# EAGLE design PCBMINI (EAGLE 9.2.0)
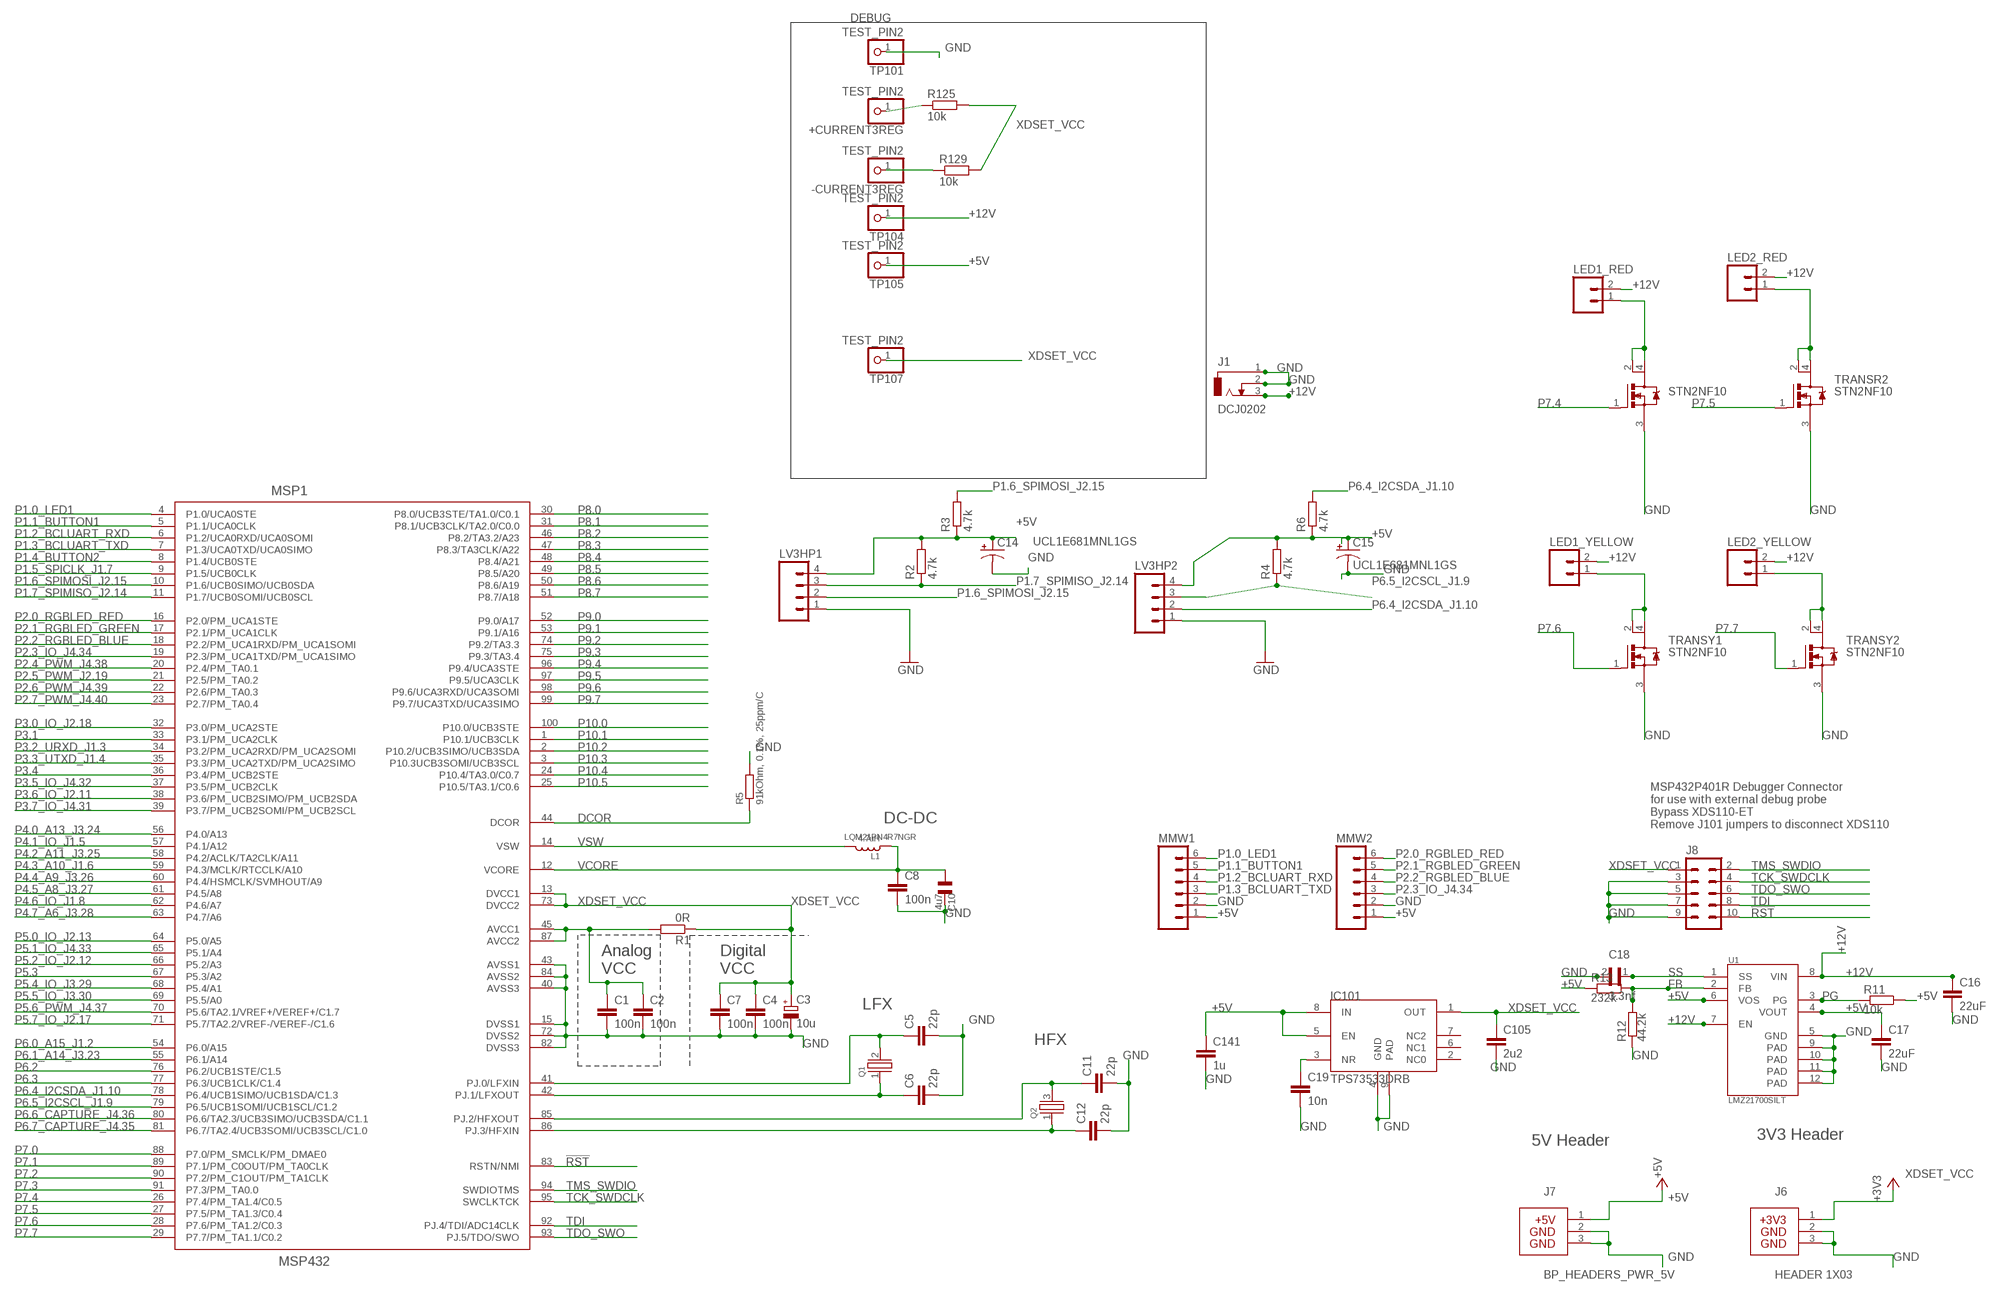
[diagram p0: schematic, sheet 1, part 1 of 2]
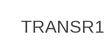
[diagram p1: schematic, sheet 1, part 2 of 2]

## Parts
+CURRENT3REG  TEST_PIN2  PINHD-1X1  [1X01]
-CURRENT3REG  TEST_PIN2  PINHD-1X1  [1X01]
C1  100n  C-EUCM0402  [0402]
C2  100n  C-EUCM0402  [0402]
C3  10u  CPOL-EUA/3216-18R  [A/3216-18R]
C4  100n  C-EUCM0402  [0402]
C5  22p  C-EUCM0402  [0402]
C6  22p  C-EUCM0402  [0402]
C7  100n  C-EUCM0402  [0402]
C8  100n  C-EUCM0402  [0402]
C10  4u7  CSMD0805  [CSMD0805]
C11  22p  C-EUCM0402  [0402]
C12  22p  C-EUCM0402  [0402]
C14  UCL1E681MNL1GS  [CAPAE1030X1350N]
C15  UCL1E681MNL1GS  [CAPAE1030X1350N]
C16  22uF  22UF-0805-6.3V-20%  [0805]
C17  22uF  22UF-0805-6.3V-20%  [0805]
C18  3.3nf  C0402C332K5RACTU  [CAPC1005X55N]
C19  10n  C-EUC0603  [C0603]
C105  2u2  C-EUC0603  [C0603]
C141  1u  C-EUC0603  [C0603]
IC101  TPS73533DRB  TPS73633DRB  [SON8]
J1  DCJ0202  [DCJ0202]
J6  HEADER 1X03  BP_HEADERS_PWR_3V3100-TH  [3PIN_PWR_3V3]
J7  BP_HEADERS_PWR_5V  [3PIN_PWR_5V]
J8  DEBUG_ARM-10  [ARM-10]
L1  4.7uH  LQM2MP_G0  [0806]
LED1_RED  MA02  [02PA]
LED1_YELLOW  MA02  [02PA]
LED2_RED  MA02  [02PA]
LED2_YELLOW  MA02  [02PA]
LV3HP1  MA04  [04PA]
LV3HP2  MA04  [04PA]
MMW1  MA06  [06PA]
MMW2  MA06  [06PA]
MSP1  MSP432  [PZ100]
Q1  CRYSTALLF_GENERAL  [LF_XTAL]
Q2  CRYSTALEPSON_FA-238  [FA-238]
R1  0R  R-EU_RM0402  [0402]
R2  4.7k  R-EU_RM0402  [0402]
R3  4.7k  R-EU_RM0402  [0402]
R4  4.7k  R-EU_RM0402  [0402]
R5  91kOhm, 0.1%, 25ppm/C  R_0805  [0805]
R6  4.7k  R-EU_RM0402  [0402]
R11  10k  SMK  [SMK]
R12  44.2k  SMK  [SMK]
R13  232k  SMK  [SMK]
R125  10k  R-EU_RM0402  [0402]
R129  10k  R-EU_RM0402  [0402]
TP101  TEST_PIN2  PINHD-1X1  [1X01]
TP104  TEST_PIN2  PINHD-1X1  [1X01]
TP105  TEST_PIN2  PINHD-1X1  [1X01]
TP107  TEST_PIN2  PINHD-1X1  [1X01]
TRANSR1  STN2NF10  [SOT230P700X180-4N]
TRANSR2  STN2NF10  [SOT230P700X180-4N]
TRANSY1  STN2NF10  [SOT230P700X180-4N]
TRANSY2  STN2NF10  [SOT230P700X180-4N]
U1  LMZ21700SILT  [DFN350X350X175-10RN]

## Nets
!RST: J8.10 MSP1.83(RSTN/NMI)
+5V: C14.A(+) C15.A(+) C17.1 C141.1 IC101.5(EN) IC101.8(IN) J7.1 LV3HP1.4 LV3HP2.4 MMW1.1 MMW2.1 R2.2 R3.1 R4.2 R6.1 R11.1 R13.2 TP105.1 U1.4(VOUT) U1.6(VOS)
+12V: C16.1 J1.3 LED1_RED.2 LED1_YELLOW.2 LED2_RED.2 LED2_YELLOW.2 TP104.1 U1.7(EN) U1.8(VIN)
DCOR: MSP1.44(DCOR) R5.1
FB: R12.1 R13.1 U1.2(FB)
GND: C1.2 C2.2 C3.- C4.2 C5.2 C6.2 C7.2 C8.2 C10.2 C11.2 C12.2 C14.C(-) C15.C(-) C16.2 C17.2 C18.2 C19.2 C105.2 C141.2 IC101.4(GND) IC101.9(PAD) J1.1 J1.2 J6.2 J6.3 J7.2 J7.3 J8.3 J8.5 J8.7 J8.9 LV3HP1.1 LV3HP2.1 MMW1.2 MMW2.2 MSP1.15(DVSS1) MSP1.40(AVSS3) MSP1.43(AVSS1) MSP1.72(DVSS2) MSP1.82(DVSS3) MSP1.84(AVSS2) R5.2 R12.2 TP101.1 TRANSR1.3(S) TRANSR2.3(S) TRANSY1.3(S) TRANSY2.3(S)
ITCK: -CURRENT3REG.1 R129.1
ITMS: +CURRENT3REG.1 R125.1
N$1: LED2_YELLOW.1 TRANSY2.2(D) TRANSY2.4(D)
N$6: C1.1 C2.1 MSP1.45(AVCC1) MSP1.87(AVCC2) R1.2
N$10: U1.5(GND) U1.9(PAD) U1.10(PAD) U1.11(PAD) U1.12(PAD)
N$11: C19.1 IC101.3(NR)
N$34: C6.1 MSP1.42(PJ.1/LFXOUT) Q1.1
N$38: C5.1 MSP1.41(PJ.0/LFXIN) Q1.2
P1.0_LED1: MMW1.6 MSP1.4(P1.0/UCA0STE)
P1.1_BUTTON1: MMW1.5 MSP1.5(P1.1/UCA0CLK)
P1.2_BCLUART_RXD: MMW1.4 MSP1.6(P1.2/UCA0RXD/UCA0SOMI)
P1.3_BCLUART_TXD: MMW1.3 MSP1.7(P1.3/UCA0TXD/UCA0SIMO)
P1.4_BUTTON2: MSP1.8(P1.4/UCB0STE)
P1.5_SPICLK_J1.7: MSP1.9(P1.5/UCB0CLK)
P1.6_SPIMOSI_J2.15: LV3HP1.2 MSP1.10(P1.6/UCB0SIMO/UCB0SDA) R3.2
P1.7_SPIMISO_J2.14: LV3HP1.3 MSP1.11(P1.7/UCB0SOMI/UCB0SCL) R2.1
P2.0_RGBLED_RED: MMW2.6 MSP1.16(P2.0/PM_UCA1STE)
P2.1_RGBLED_GREEN: MMW2.5 MSP1.17(P2.1/PM_UCA1CLK)
P2.2_RGBLED_BLUE: MMW2.4 MSP1.18(P2.2/PM_UCA1RXD/PM_UCA1SOMI)
P2.3_IO_J4.34: MMW2.3 MSP1.19(P2.3/PM_UCA1TXD/PM_UCA1SIMO)
P2.4_PWM_J4.38: MSP1.20(P2.4/PM_TA0.1)
P2.5_PWM_J2.19: MSP1.21(P2.5/PM_TA0.2)
P2.6_PWM_J4.39: MSP1.22(P2.6/PM_TA0.3)
P2.7_PWM_J4.40: MSP1.23(P2.7/PM_TA0.4)
P3.0_IO_J2.18: MSP1.32(P3.0/PM_UCA2STE)
P3.1: MSP1.33(P3.1/PM_UCA2CLK)
P3.2_URXD_J1.3: MSP1.34(P3.2/PM_UCA2RXD/PM_UCA2SOMI)
P3.3_UTXD_J1.4: MSP1.35(P3.3/PM_UCA2TXD/PM_UCA2SIMO)
P3.4: MSP1.36(P3.4/PM_UCB2STE)
P3.5_IO_J4.32: MSP1.37(P3.5/PM_UCB2CLK)
P3.6_IO_J2.11: MSP1.38(P3.6/PM_UCB2SIMO/PM_UCB2SDA)
P3.7_IO_J4.31: MSP1.39(P3.7/PM_UCB2SOMI/PM_UCB2SCL)
P4.0_A13_J3.24: MSP1.56(P4.0/A13)
P4.1_IO_J1.5: MSP1.57(P4.1/A12)
P4.2_A11_J3.25: MSP1.58(P4.2/ACLK/TA2CLK/A11)
P4.3_A10_J1.6: MSP1.59(P4.3/MCLK/RTCCLK/A10)
P4.4_A9_J3.26: MSP1.60(P4.4/HSMCLK/SVMHOUT/A9)
P4.5_A8_J3.27: MSP1.61(P4.5/A8)
P4.6_IO_J1.8: MSP1.62(P4.6/A7)
P4.7_A6_J3.28: MSP1.63(P4.7/A6)
P5.0_IO_J2.13: MSP1.64(P5.0/A5)
P5.1_IO_J4.33: MSP1.65(P5.1/A4)
P5.2/XT2IN: C12.1 MSP1.86(PJ.3/HFXIN) Q2.1
P5.2_IO_J2.12: MSP1.66(P5.2/A3)
P5.3: MSP1.67(P5.3/A2)
P5.3/XT2OUT: C11.1 MSP1.85(PJ.2/HFXOUT) Q2.3
P5.4_IO_J3.29: MSP1.68(P5.4/A1)
P5.5_IO_J3.30: MSP1.69(P5.5/A0)
P5.6_PWM_J4.37: MSP1.70(P5.6/TA2.1/VREF+/VEREF+/C1.7)
P5.7_IO_J2.17: MSP1.71(P5.7/TA2.2/VREF-/VEREF-/C1.6)
P6.0_A15_J1.2: MSP1.54(P6.0/A15)
P6.1_A14_J3.23: MSP1.55(P6.1/A14)
P6.2: MSP1.76(P6.2/UCB1STE/C1.5)
P6.3: MSP1.77(P6.3/UCB1CLK/C1.4)
P6.4_I2CSDA_J1.10: LV3HP2.2 MSP1.78(P6.4/UCB1SIMO/UCB1SDA/C1.3) R6.2
P6.5_I2CSCL_J1.9: LV3HP2.3 MSP1.79(P6.5/UCB1SOMI/UCB1SCL/C1.2) R4.1
P6.6_CAPTURE_J4.36: MSP1.80(P6.6/TA2.3/UCB3SIMO/UCB3SDA/C1.1)
P6.7_CAPTURE_J4.35: MSP1.81(P6.7/TA2.4/UCB3SOMI/UCB3SCL/C1.0)
P7.0: MSP1.88(P7.0/PM_SMCLK/PM_DMAE0)
P7.1: MSP1.89(P7.1/PM_C0OUT/PM_TA0CLK)
P7.2: MSP1.90(P7.2/PM_C1OUT/PM_TA1CLK)
P7.3: MSP1.91(P7.3/PM_TA0.0)
P7.4: MSP1.26(P7.4/PM_TA1.4/C0.5) TRANSR1.1(G)
P7.5: MSP1.27(P7.5/PM_TA1.3/C0.4) TRANSR2.1(G)
P7.6: MSP1.28(P7.6/PM_TA1.2/C0.3) TRANSY1.1(G)
P7.7: MSP1.29(P7.7/PM_TA1.1/C0.2) TRANSY2.1(G)
P8.0: MSP1.30(P8.0/UCB3STE/TA1.0/C0.1)
P8.1: MSP1.31(P8.1/UCB3CLK/TA2.0/C0.0)
P8.2: MSP1.46(P8.2/TA3.2/A23)
P8.3: MSP1.47(P8.3/TA3CLK/A22)
P8.4: MSP1.48(P8.4/A21)
P8.5: MSP1.49(P8.5/A20)
P8.6: MSP1.50(P8.6/A19)
P8.7: MSP1.51(P8.7/A18)
P9.0: MSP1.52(P9.0/A17)
P9.1: MSP1.53(P9.1/A16)
P9.2: MSP1.74(P9.2/TA3.3)
P9.3: MSP1.75(P9.3/TA3.4)
P9.4: MSP1.96(P9.4/UCA3STE)
P9.5: MSP1.97(P9.5/UCA3CLK)
P9.6: MSP1.98(P9.6/UCA3RXD/UCA3SOMI)
P9.7: MSP1.99(P9.7/UCA3TXD/UCA3SIMO)
P10.0: MSP1.100(P10.0/UCB3STE)
P10.1: MSP1.1(P10.1/UCB3CLK)
P10.2: MSP1.2(P10.2/UCB3SIMO/UCB3SDA)
P10.3: MSP1.3(P10.3UCB3SOMI/UCB3SCL)
P10.4: MSP1.24(P10.4/TA3.0/C0.7)
P10.5: MSP1.25(P10.5/TA3.1/C0.6)
PG: R11.2 U1.3(PG)
R1: LED1_RED.1 TRANSR1.2(D) TRANSR1.4(D)
R2: LED2_RED.1 TRANSR2.2(D) TRANSR2.4(D)
SS: C18.1 U1.1(SS)
TCK_SWDCLK: J8.4 MSP1.95(SWCLKTCK)
TDI: J8.8 MSP1.92(PJ.4/TDI/ADC14CLK)
TDO_SWO: J8.6 MSP1.93(PJ.5/TDO/SWO)
TMS_SWDIO: J8.2 MSP1.94(SWDIOTMS)
VCORE: C8.1 C10.1 L1.1 MSP1.12(VCORE)
VSW: L1.2 MSP1.14(VSW)
XDSET_VCC: C3.+ C4.1 C7.1 C105.1 IC101.1(OUT) J6.1 J8.1 MSP1.13(DVCC1) MSP1.73(DVCC2) R1.1 R125.2 R129.2 TP107.1 ; supply symbol labelled +3V3
Y1: LED1_YELLOW.1 TRANSY1.2(D) TRANSY1.4(D)
Unconnected: IC101.2(NC0) IC101.6(NC1) IC101.7(NC2)

## Notes on the sheet
- DEBUG
- DC-DC
- MSP432P401R Debugger Connector
  for use with external debug probe
  Bypass XDS110-ET
  Remove J101 jumpers to disconnect XDS110
- LQM21PN4R7NGR
- Analog | Digital
- VCC | VCC
- LFX
- HFX
- 3V3 Header
- 5V Header

## Library data of the parts
+CURRENT3REG -CURRENT3REG TP101 TP104 TP105 TP107 = pinhead:PINHD-1X1: PIN HEADER
C1 C2 C4-C8 C11 C12 C19 C105 C141 = rcl:C-EU: CAPACITOR, European symbol
C3 = rcl:CPOL-EU: POLARIZED CAPACITOR, European symbol
C10 = cap:CSMD0805
C14 C15 = UCL1E681MNL1GS:UCL1E681MNL1GS: Cap Aluminum Lytic 680uF 25V 20% (10 X 13.5mm) SMD 1190mA 2000h 105C Automotive T/R; AVAILABILITY: Unavailable; DESCRIPTION: Cap Aluminum Lytic 680uF 25V 20% _10 X 13.5mm_ SMD 1190mA 2000h 105C Automotive T/R; MF: Nichicon; MP: UCL1E681MNL1GS; PACKAGE: Radial Nichicon; PRICE: None
C16 C17 = SparkFun-Capacitors:22UF: 22µF ceramic capacitors A capacitor is a passive two-terminal electrical component used to store electrical energy temporarily in an electric field.; PROD_ID: CAP-08402
C18 = C0402C332K5RACTU:C0402C332K5RACTU: CAPACITOR MLCC, 3300PF, 50V, 10%, 0402; Product Range:KEMET - C Series; Capacitance:3300pF; Capacitance Tolerance:± 10%; Dielectric Characteristic:X7R; Voltage Rating:50V; Capacitor Case Style:0402 [1005 Metric]; Operating ;RoHS Compliant: Yes; AVAILABILITY: Unavailable; DESCRIPTION: Capacitor; Ceramic; Cap; 3300pf ; Tol+10%; Smd; Vol-Rtg 50v; X7r; MF: KEMET; MP: C0402C332K5RACTU; PACKAGE: 0402 KEMET; PRICE: None
IC101 = MSP430G6_LP:TPS73633DRB
J1 = con-jack:DCJ0202: DC POWER JACK Source: DCJ0202.pdf; OC_FARNELL: unknown; OC_NEWARK: unknown
J6 = LaunchPad_Template_Library:BP_HEADERS_PWR_3V3; CCO: 258-0001299; DESCRIPTION: CONN HEADER .100 SINGL STR 3POS; MAN: SULLINS
J7 = LaunchPad_Template_Library:BP_HEADERS_PWR_5V
J8 = MSP430_Headers:DEBUG_ARM-10; SAMTEC: FTSH-105-01-F-D-K
L1 = Murata:LQM2MP_G0
LED1_RED LED1_YELLOW LED2_RED LED2_YELLOW = con-amp-quick:MA02: AMP QUICK CONNECTOR; OC_FARNELL: unknown; OC_NEWARK: unknown
LV3HP1 LV3HP2 = con-amp-quick:MA04: AMP QUICK CONNECTOR; OC_FARNELL: unknown; OC_NEWARK: unknown
MMW1 MMW2 = con-amp-quick:MA06: AMP QUICK CONNECTOR; OC_FARNELL: unknown; OC_NEWARK: unknown
MSP1 = MSP-EXP432:MSP432
Q1 Q2 = MSP_Crystals:CRYSTAL
R1-R4 R6 R125 R129 = rcl:R-EU_: RESISTOR, European symbol
R5 = smd:R_0805
R11-R13 = resistor-shunt:SMK: SMD SHUNT RESISTOR; OC_FARNELL: unknown; OC_NEWARK: unknown
TRANSR1 TRANSR2 TRANSY1 TRANSY2 = STN2NF10:STN2NF10: N-channel 100 V, 0.23 Ohm, 2.4 A STripFET(TM) II POWER MOSFET in SOT-223 package; AVAILABILITY: Unavailable; DESCRIPTION: N-channel 100 V, 0.23 Ohm, 2.4 A STripFET_TM_ II POWER MOSFET in SOT-223 package; MF: STMicroelectronics; MP: STN2NF10; PACKAGE: SOT-223 STMicroelectronics; PRICE: None
U1 = LMZ21700SILT:LMZ21700SILT: 650mA SIMPLE SWITCHER? Nano Module with 17V Maximum Input Voltage 8-uSiP -40 to 125; AVAILABILITY: Unavailable; DESCRIPTION: 650mA SIMPLE SWITCHER? Nano Module with 17V Maximum Input Voltage 8-uSiP -40 to 125; MF: Texas Instruments; MP: LMZ21700SILT; PACKAGE: SMD-8 Texas Instruments; PRICE: None

## Net classes
0 default: width 0.254 mm
2 Power: width 0.203 mm, drill 0.305 mm, clearance 0.152 mm to class 0, clearance 0.152 mm to class 1, clearance 0.152 mm

## Board
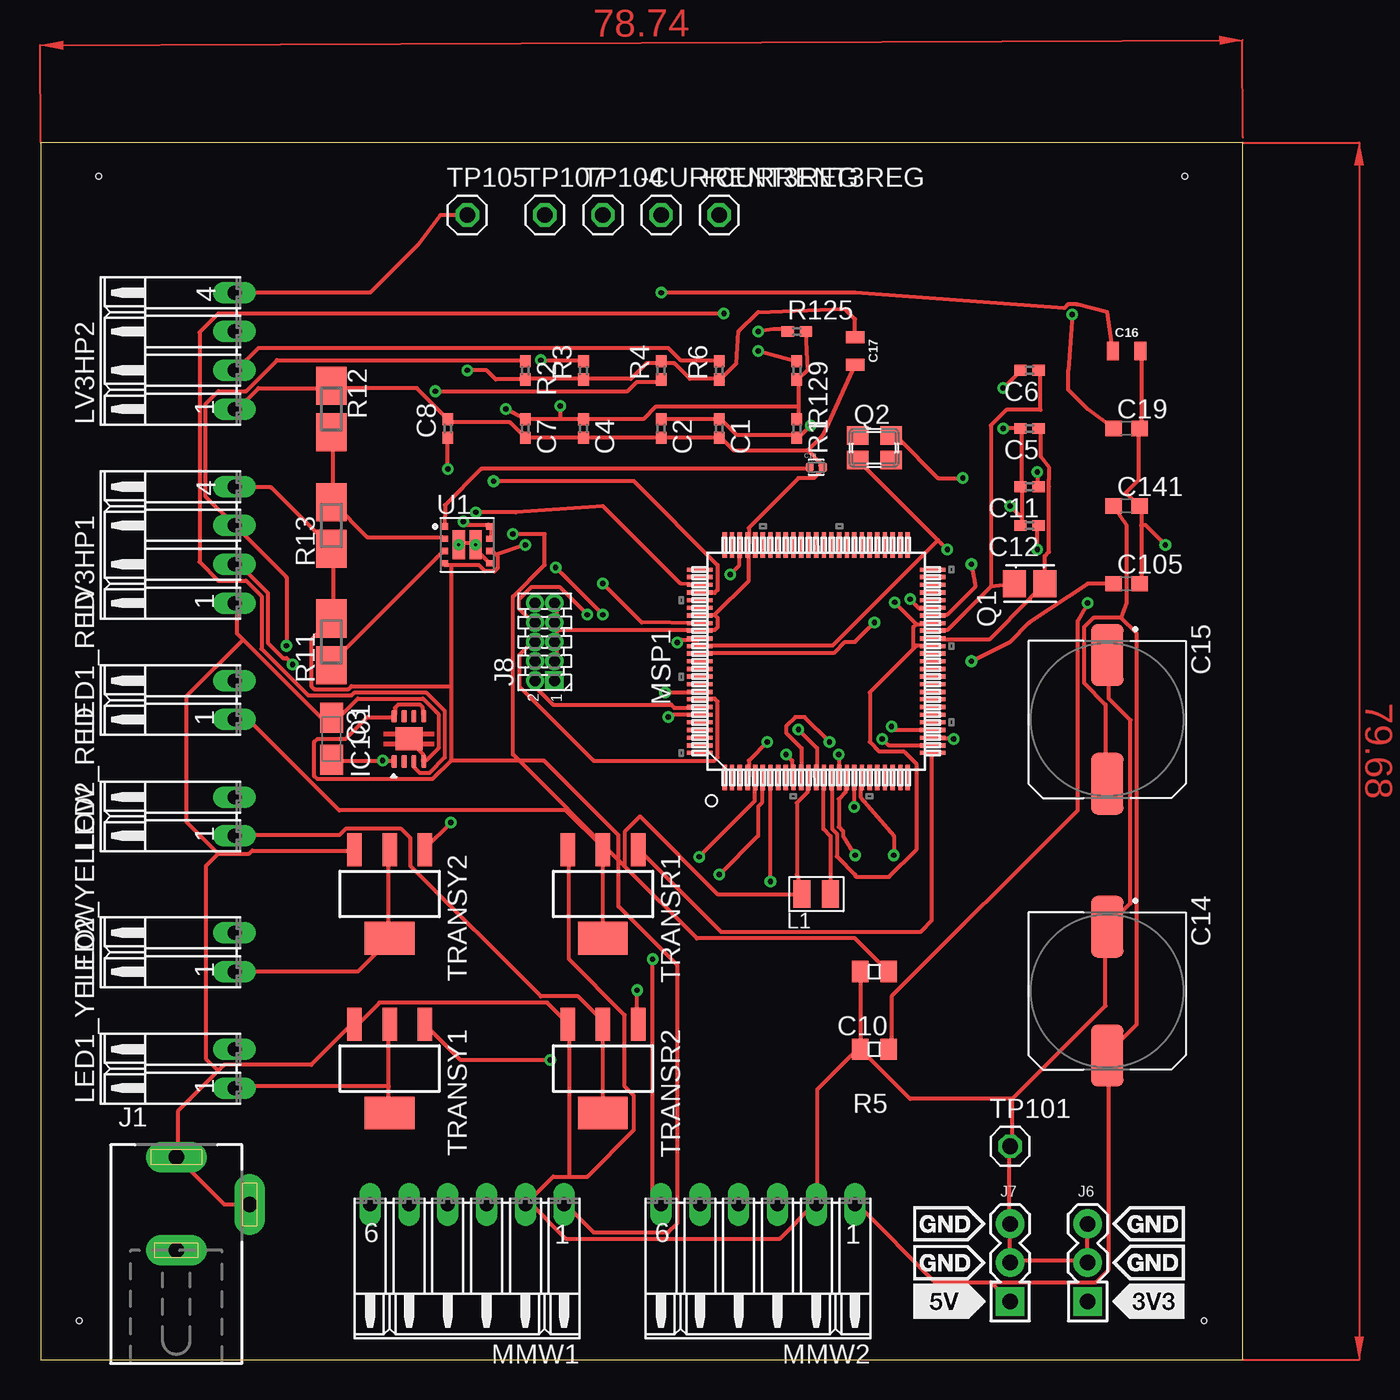
[diagram p2: board, top side]
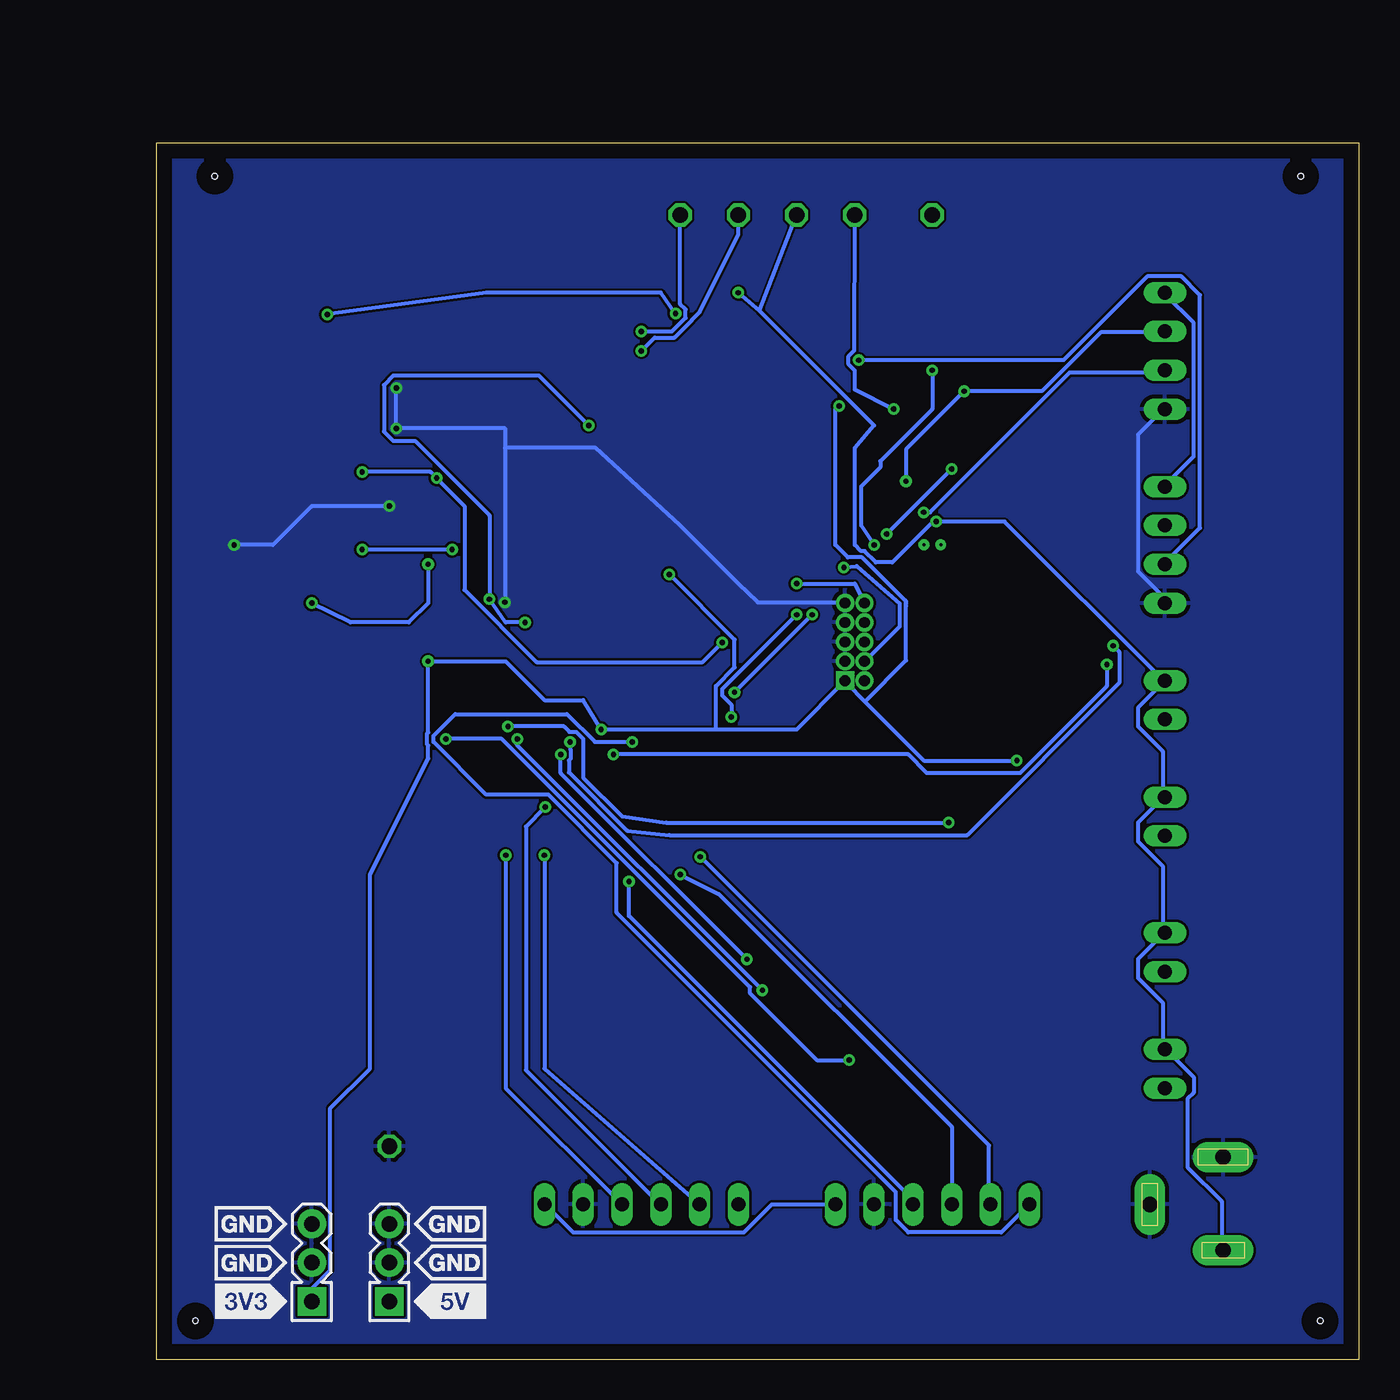
[diagram p3: board, bottom side, seen from below]

Size 78.72 x 79.68 mm. Coordinates in mm from the lower left corner, seen from the top.
Outline: 0,0 78.72,0 78.72,79.68 0,79.68 0,0
Copper layers (1*16): Top 0.035mm / dielectric 1.5mm / Bottom 0.035mm
Design rules "default": minimum track width 6mil, minimum drill 0.35mm, track to track 6mil, track to pad 6mil, pad to pad 6mil, via to via 6mil, smd to smd 6mil, copper to edge 40mil, drill to drill 6mil, minimum pad ring 10mil, minimum via ring 8mil, stop-mask expansion 4mil, vias tented up to drill 0mil, thermal gap 10mil
Holes 0.35 mm at 3.81,77.47 74.93,77.47 76.2,2.54 2.54,2.54

### Footprints (pad centres in the part's own frame; a part is rotated, then mirrored left to right if it is on the bottom)
1X01 = drill 1.016 octagon: 1 0,0
0402 = smd 0.8 x 0.7: 1 -0.6,0; 2 0.6,0
A/3216-18R = smd 1.95 x 1.5: + 1.375,0; - -1.375,0
CSMD0805 = smd 1.092 x 1.397: 1 -0.94,0; 2 0.94,0
CAPAE1030X1350N = smd 4.04 x 2.12: A 4.215,0; C -4.215,0
0805 = smd 0.8 x 1.2: 1 -0.9,0; 2 0.9,0
CAPC1005X55N = smd 0.54 x 0.6: 1 -0.43,0; 2 0.43,0
C0603 = smd 1.1 x 1: 1 -0.85,0; 2 0.85,0
SON8 = smd 0.85 x 0.35: 1 -1.475,0.975; 2 -1.475,0.325; 3 -1.475,-0.325; 4 -1.475,-0.975; 5 1.475,-0.975; 6 1.475,-0.325; 7 1.475,0.325; 8 1.475,0.975 | smd 1.5 x 1.75: 9 0,0
DCJ0202 = drill 1 pad 2 long: 1 0,3.1; 2 4.8,0; 3 0,-3
3PIN_PWR_3V3 = drill 1.016 pad 1.88 square: 1 0,0 | drill 1.016 pad 1.88: 2 0,2.54; 3 0,5.08
3PIN_PWR_5V = drill 1.016 pad 1.88 square: 1 0,0 | drill 1.016 pad 1.88: 2 0,2.54; 3 0,5.08
ARM-10 = drill 0.7 pad 0.95 square: 1 -2.54,-0.635 | drill 0.7 pad 0.95: 2 -2.54,0.635; 3 -1.27,-0.635; 4 -1.27,0.635; 5 0,-0.635; 6 0,0.635; 7 1.27,-0.635; 8 1.27,0.635; 9 2.54,-0.635; 10 2.54,0.635
0806 = smd 1.1 x 1.8: 1 -0.94,0; 2 0.94,0
02PA = drill 0.914 long: 1 -1.27,0; 2 1.27,0
04PA = drill 0.914 long: 1 -3.81,0; 2 -1.27,0; 3 1.27,0; 4 3.81,0
06PA = drill 0.914 long: 1 -6.35,0; 2 -3.81,0; 3 -1.27,0; 4 1.27,0; 5 3.81,0; 6 6.35,0
PZ100 = smd 1.676 x 0.279: 1 -7.62,5.994; 2 -7.62,5.512; 3 -7.62,5.004; 4 -7.62,4.496; 5 -7.62,3.988; 6 -7.62,3.505; 7 -7.62,2.997; 8 -7.62,2.489; 9 -7.62,2.007; 10 -7.62,1.499; 11 -7.62,0.991; 12 -7.62,0.508; 13 -7.62,0; 14 -7.62,-0.508; 15 -7.62,-0.991; 16 -7.62,-1.499; 17 -7.62,-2.007; 18 -7.62,-2.489; 19 -7.62,-2.997; 20 -7.62,-3.505; 21 -7.62,-3.988; 22 -7.62,-4.496; 23 -7.62,-5.004; 24 -7.62,-5.512; 25 -7.62,-5.994; 51 7.62,-5.994; 52 7.62,-5.512; 53 7.62,-5.004; 54 7.62,-4.496; 55 7.62,-3.988; 56 7.62,-3.505; 57 7.62,-2.997; 58 7.62,-2.489; 59 7.62,-2.007; 60 7.62,-1.499; 61 7.62,-0.991; 62 7.62,-0.508; 63 7.62,0; 64 7.62,0.508; 65 7.62,0.991; 66 7.62,1.499; 67 7.62,2.007; 68 7.62,2.489; 69 7.62,2.997; 70 7.62,3.505; 71 7.62,3.988; 72 7.62,4.496; 73 7.62,5.004; 74 7.62,5.512; 75 7.62,5.994 | smd 0.279 x 1.676: 26 -5.994,-7.62; 27 -5.512,-7.62; 28 -5.004,-7.62; 29 -4.496,-7.62; 30 -3.988,-7.62; 31 -3.505,-7.62; 32 -2.997,-7.62; 33 -2.489,-7.62; 34 -2.007,-7.62; 35 -1.499,-7.62; 36 -0.991,-7.62; 37 -0.508,-7.62; 38 0,-7.62; 39 0.508,-7.62; 40 0.991,-7.62; 41 1.499,-7.62; 42 2.007,-7.62; 43 2.489,-7.62; 44 2.997,-7.62; 45 3.505,-7.62; 46 3.988,-7.62; 47 4.496,-7.62; 48 5.004,-7.62; 49 5.512,-7.62; 50 5.994,-7.62; 76 5.994,7.62; 77 5.512,7.62; 78 5.004,7.62; 79 4.496,7.62; 80 3.988,7.62; 81 3.505,7.62; 82 2.997,7.62; 83 2.489,7.62; 84 2.007,7.62; 85 1.499,7.62; 86 0.991,7.62; 87 0.508,7.62; 88 0,7.62; 89 -0.508,7.62; 90 -0.991,7.62; 91 -1.499,7.62; 92 -2.007,7.62; 93 -2.489,7.62; 94 -2.997,7.62; 95 -3.505,7.62; 96 -3.988,7.62; 97 -4.496,7.62; 98 -5.004,7.62; 99 -5.512,7.62; 100 -5.994,7.62
LF_XTAL = smd 1.75 x 1.5: 1 0,1; 2 0,-1
FA-238 = smd 1.4 x 1.2: 1 -1.1,-0.8; 2 1.1,-0.8; 3 1.1,0.8; 4 -1.1,0.8
0805' = smd 1.092 x 1.397: 1 -0.94,0; 2 0.94,0
SMK = smd 2.5 x 2: 1 1.524,0; 2 -1.524,0
SOT230P700X180-4N = smd 2.15 x 0.95: 1 -2.9,2.3; 2 -2.9,0; 3 -2.9,-2.3 | smd 2.15 x 3.25: 4 2.9,0
DFN350X350X175-10RN = smd 0.45 x 0.4: 1 -1.475,1.2; 2 -1.475,0.4; 3 -1.475,-0.4; 4 -1.475,-1.2; 5 1.475,-1.2; 6 1.475,-0.4; 7 1.475,0.4; 8 1.475,1.2 | smd 0.8 x 1.9: 9 -0.55,0; 10 0.55,0 | drill 0.2 pad 0.4: 11 -0.55,0; 12 0.55,0

### Placement (x,y rotation side)
+CURRENT3REG  44.45,74.93 0 top
-CURRENT3REG  40.64,74.93 0 top
C1  44.45,60.96 270 top
C2  40.64,60.96 270 top
C3  19.05,40.64 270 top
C4  35.56,60.96 270 top
C5  64.77,60.96 180 top
C6  64.77,64.77 180 top
C7  31.75,60.96 270 top
C8  26.67,60.96 90 top
C10  54.61,25.4 180 top
C11  64.77,57.15 180 top
C12  64.77,54.61 180 top
C14  69.85,24.13 270 top
C15  69.85,41.91 270 top
C16  71.12,66.04 0 top
C17  53.34,66.04 270 top
C18  50.8,58.42 0 top
C19  71.12,60.96 0 top
C105  71.12,50.8 0 top
C141  71.12,55.88 0 top
IC101  24.13,40.64 90 top
J1  8.89,10.16 0 top
J6  68.58,3.81 0 top
J7  63.5,3.81 0 top
J8  33.02,46.99 90 top
L1  50.8,30.48 0 top
LED1_RED  12.7,43.18 90 top
LED1_YELLOW  12.7,19.05 90 top
LED2_RED  12.7,35.56 90 top
LED2_YELLOW  12.7,26.67 90 top
LV3HP1  12.7,53.34 90 top
LV3HP2  12.7,66.04 90 top
MMW1  27.94,10.16 180 top
MMW2  46.99,10.16 180 top
MSP1  50.8,45.72 90 top
Q1  64.77,50.8 90 top
Q2  54.61,59.69 0 top
R1  49.53,60.96 270 top
R2  31.75,64.77 270 top
R3  35.56,64.77 90 top
R4  40.64,64.77 90 top
R5  91kOhm, 0.1%, 25ppm/C  [0805']  54.61,20.32 180 top
R6  44.45,64.77 90 top
R11  19.05,46.99 90 top
R12  19.05,62.23 270 top
R13  19.05,54.61 90 top
R125  49.53,67.31 0 top
R129  49.53,64.77 270 top
TP101  63.5,13.97 0 top
TP104  36.83,74.93 0 top
TP105  27.94,74.93 0 top
TP107  33.02,74.93 0 top
TRANSR1  36.83,30.48 270 top
TRANSR2  36.83,19.05 270 top
TRANSY1  22.86,19.05 270 top
TRANSY2  22.86,30.48 270 top
U1  27.94,53.34 0 top

### Tracks (layer width: path | path; a pad name or v marks a point on that pad's centre or on a via)
!RST  (via drill 0.35)
  Top 0.254: MSP1.83 39.37,48.26 v36.83,50.8
  Bottom 0.254: v36.83,50.8 33.02,50.8 J8.10
+5V  (via drill 0.35)
  Top 0.254: IC101.5 25.04,42.27 25.04,42.67 24.84,42.88 23.42,42.88 23.22,42.67 23.22,42.27 IC101.8 23.01,42.06 21.39,42.06 19.96,40.64 18.14,40.64 17.93,40.44 17.93,38.2 18.14,38 25.65,38 26.87,39.22 | 26.87,52.02 28.7,52.02 29.11,51.61 29.72,51.61 29.92,51.82 29.92,52.63 29.84,52.7 | 26.87,52.02 26.47,52.02 U1.4 | 29.84,52.7 29.52,53.03 U1.6 | 26.87,52.02 26.87,44.09 | 26.87,44.09 26.87,39.22 | LV3HP1.4 12.85,57.1 15.09,57.1 18.95,53.24 R13.2 19.15,53.03 19.15,48.56 R11.1 18.95,48.36 17.73,47.14 17.73,44.09 17.93,43.89 20.17,43.89 20.37,44.09 26.87,44.09 | 62.23,5.08 58.57,5.08 53.49,10.16 MMW2.1 | 62.23,5.08 69.14,5.08 69.95,5.89 69.95,19.91 C14.A 69.95,20.12 71.78,21.95 71.78,47.55 70.76,48.56 | 70.76,48.56 68.94,48.56 68.33,47.95 68.33,44.3 69.75,42.88 69.75,37.8 C15.A | 26.87,39.22 32.97,39.22 37.85,34.34 37.85,29.67 41.71,25.81 41.71,8.94 41.1,8.33 36.22,8.33 34.39,10.16 MMW1.1 | v27.94,64.77 29.21,64.77 29.81,64.17 R2.2 31.75,64.21 35.41,64.21 R3.1 35.61,64.21 38.66,64.21 39.68,65.23 40.49,65.23 R4.2 40.69,65.23 41.5,65.23 42.52,64.21 44.35,64.21 R6.1 44.55,64.21 45.57,65.23 45.72,67.31 46.99,68.58 52.66,68.8 53.34,68.11 C17.1 | v31.75,53.34 29.84,52.7 | TP105.1 26.17,74.93 24.67,72.93 21.59,69.85 LV3HP2.4 | C141.1 71.12,54.61 71.12,49.53 70.76,48.56 | J7.1 62.23,5.08
  Bottom 0.254: LV3HP2.4 12.65,69.7 10.82,67.87 10.82,59.13 12.65,57.3 LV3HP1.4 | MMW1.1 38.46,10.16 40.28,8.33 51.46,8.33 53.29,10.16 MMW2.1 | v27.94,64.77 27.94,62.23 31.34,58.83 31.34,58.42 32.61,57.15 32.61,54.61 v31.75,53.34
+12V  (via drill 0.35)
  Top 0.254: U1.7 29.52,53.85 29.52,54.46 U1.8 29.31,54.66 27.89,54.66 v27.69,54.86 | C16.1 69.85,68.58 67.84,69.08 67.29,69.08 67.05,68.84 53.34,69.85 v40.64,69.85
  Bottom 0.254: J1.3 8.99,7.32 8.99,10.36 11.23,12.6 11.23,17.07 10.82,17.48 10.82,18.49 12.65,20.32 LED1_YELLOW.2 12.85,20.32 12.85,23.37 14.48,24.99 14.48,26.21 12.85,27.84 LED2_YELLOW.2 12.85,28.04 12.85,32.31 14.48,33.93 14.48,35.15 12.85,36.78 LED2_RED.2 12.85,36.98 12.85,39.83 14.48,41.45 14.48,42.67 LED1_RED.2 12.85,44.5 23.22,54.86 v27.69,54.86 27.89,54.86 30.57,52.19 31.63,52.19 32.37,52.93 32.61,52.93 33.02,53.34 33.02,59.69 31.75,61.16 39.27,68.68 | 39.27,68.68 TP104.1 | v40.64,69.85 39.27,68.68
DCOR  (via drill 0.35)
  Top 0.254: R5.1 55.73,20.32 55.73,23.77 67.92,35.97 67.92,48.36 v68.58,49.53 | MSP1.44 58.57,48.77 59.39,48.77 61.21,50.6 v60.96,52.07
  Bottom 0.254: v60.96,52.07 60.96,49.53 62.23,48.26 66.04,48.26 v68.58,49.53
FB
  Top 0.254: U1.2 26.26,53.85 21.39,53.85 19.15,56.08 R13.1 19.15,56.29 19.15,60.55 R12.1
GND  (via drill 0.35)
  Top 0.254: 53.7,20.32 53.7,25.4 C10.2 | 68.53,6.5 68.53,8.74 J6.3 | 63.65,17.07 69.75,23.16 69.75,28.25 C14.C 69.95,28.45 71.37,29.87 71.37,41.86 69.95,43.28 69.95,45.92 C15.C | 63.65,17.07 63.65,14.02 TP101.1 63.45,13.82 63.45,8.94 J7.3 63.45,8.74 63.45,6.5 J7.2 63.65,6.5 68.53,6.5 | 68.53,6.5 J6.2 | 53.7,20.32 56.95,17.07 63.65,17.07 | 53.7,20.32 R5.2 53.49,20.32 50.85,17.68 50.85,10.16 MMW2.2 50.65,10.16 48.41,7.92 34.39,7.92 31.95,10.36 | 57.15,46.53 57.35,46.74 58.37,46.74 MSP1.40 | 57.15,46.53 54.3,43.69 54.3,40.44 54.92,39.83 56.54,39.83 57.35,39.01 57.35,33.38 55.58,31.6 53.49,31.6 arc-90 53.34,31.75 52.15,32.94 52.15,34.43 51.87,34.71 51.87,38 MSP1.15 | 57.35,48.16 58.37,48.16 MSP1.43 | 57.35,48.16 57.15,47.95 57.15,46.53 | 64.26,55.12 64.26,57.1 C11.2 64.26,57.3 64.26,60.96 C5.2 v63.04,60.96 | C12.2 64.26,54.76 64.26,55.12 | v63.04,63.6 64.06,64.62 C6.2 | J8.3 33.78,45.72 33.78,46.94 J8.5 33.78,47.14 33.78,47.75 | J8.7 33.78,48.36 33.78,49.38 J8.9 | 33.78,47.75 33.78,48.16 J8.7 | 44.15,48.77 44.35,48.56 44.35,47.95 44.15,47.75 43.33,47.75 MSP1.84 43.13,47.75 33.78,47.75 | 44.15,48.77 43.33,48.77 MSP1.82 | 44.15,48.77 46.38,51 46.38,53.24 MSP1.72 46.38,53.44 46.38,54.46 49.63,57.71 50.65,57.71 51.26,58.32 C18.2 51.05,58.52 51.05,58.73 50.24,59.54 | 33.78,47.75 J8.7 | v55.93,49.58 57.35,48.16 | 34.6,11.99 33.58,11.99 31.95,10.36 | 34.6,11.99 35.81,11.99 38.86,15.04 38.86,17.27 38.25,17.88 38.25,22.55 34.6,26.21 34.6,33.33 TRANSR1.3 | J1.2 12.04,10.16 8.99,13.21 J1.1 8.99,13.41 8.99,16.26 11.63,18.9 | 11.63,18.9 12.04,19.3 17.73,19.3 20.37,21.95 TRANSY1.3 20.57,22.15 20.98,22.15 22.2,23.37 33.17,23.37 34.39,22.15 TRANSR2.3 34.6,21.95 34.6,11.99
  Top 0.254: IC101.9 24.03,40.64 25.04,39.62 25.04,39.22 IC101.4 25.25,39.22 26.06,40.03 26.06,42.27 25.04,43.28 20.78,43.28 19.56,42.06 19.15,42.06 C3.- 18.95,42.06 18.34,42.06 13.26,47.14 | 13.26,47.14 12.85,47.55 12.85,49.38 LV3HP1.1 | 11.63,33.12 13.66,33.12 13.87,33.33 20.37,33.33 TRANSY2.3 | 11.63,33.12 9.55,35.2 9.55,43.43 13.26,47.14 | C16.2 72.08,65.89 72.08,61.01 C19.2 71.88,60.81 71.88,57.56 71.07,56.74 71.88,55.93 C141.2 72.08,55.73 72.08,54.61 | 72.08,54.61 72.08,50.85 C105.2 | LV3HP2.1 12.85,62.18 14.28,63.6 18.95,63.6 R12.2 19.15,63.6 24.64,63.6 C8.2 26.67,61.37 30.73,61.37 C7.2 | C7.2 35.41,60.35 C4.2 35.61,60.35 40.49,60.35 C2.2 40.69,60.35 44.35,60.35 C1.2 44.55,60.35 45.36,59.54 50.24,59.54 | C7.2 | 50.24,59.54 51.23,60.53 C17.2 | 11.63,18.9 10.82,19.71 10.82,32.31 11.63,33.12 | 31.95,10.36 MMW1.2 | v63.5,55.88 64.26,55.12 | v73.66,53.34 72.39,54.61 72.08,54.61
  Bottom 0.254: v63.04,63.6 v63.04,60.96 55.93,60.96 55.93,59.69 | 55.93,59.69 49.99,59.69 44.45,54.61 40.64,50.8 39.37,49.58 33.78,49.58 J8.9 | 55.93,59.69 v55.93,49.58 | LV3HP1.1 12.85,49.58 12.85,49.99 14.48,51.61 14.48,60.55 12.85,62.18 LV3HP2.1 | v63.5,55.88 68.58,55.88 71.12,53.34 v73.66,53.34
  pour Bottom: -2.54,83.82 -2.54,-2.54 81.28,-2.54 81.28,83.82
ITCK  (via drill 0.35)
  Top 0.254: v46.99,66.04 R129.1
  Bottom 0.254: v46.99,66.04 46.13,66.9 44.83,66.9 43.69,68.04 43.69,68.07 43.18,68.58 40.64,73.66 -CURRENT3REG.1
ITMS  (via drill 0.35)
  Top 0.254: R125.1 48.82,67.46 48.01,67.46 v46.99,67.31
  Bottom 0.254: v46.99,67.31 44.99,67.31 44.1,68.21 44.1,68.75 44.45,69.1 +CURRENT3REG.1
N$1
  Top 0.254: TRANSY2.2 22.81,33.33 22.81,27.64 TRANSY2.4 22.81,27.43 20.78,25.4 LED2_YELLOW.1
N$6  (via drill 0.35)
  Top 0.254: C2.1 40.69,61.57 44.35,61.57 C1.1 44.55,61.57 45.57,60.55 49.43,60.55 R1.2 49.63,60.35 v50.44,61.16 | v56.95,49.78 57.56,49.17 58.37,49.17 MSP1.45 | MSP1.87 43.24,46.29 52,46.29 52.7,46.99 53.34,46.99 v54.61,48.26
  Bottom 0.254: v50.44,61.16 53.7,64.41 63.25,64.41 63.86,63.8 63.86,60.76 63.25,60.15 61.82,60.15 56.95,55.27 v56.95,49.78 55.87,48.27 55.86,48.26 v54.61,48.26
N$10
  Top 0.254: U1.5 29.31,52.22 28.3,53.24 U1.12 28.3,53.44 27.48,53.44 U1.11
N$11  (via drill 0.35)
  Top 0.254: v44.76,68.48 11.63,68.48 10.41,67.26 10.41,52.22 11.63,51 13.46,51 14.48,49.99 14.48,46.53 17.53,43.48 20.37,43.48 20.57,43.69 25.25,43.69 26.47,42.47 26.47,39.42 25.45,38.41 24.84,38.41 24.43,38.81 24.43,39.01 IC101.3 | C19.1 68.58,62.23 67.31,63.5 67.31,64.77 v67.56,68.43
  Bottom 0.254: v44.76,68.48 45.72,69.85 57.15,69.85 v67.56,68.43
N$34
  Top 0.254: C6.1 65.48,64.62 65.48,62.18 63.25,62.18 62.23,61.16 62.23,50.6 | 62.23,50.6 59.39,47.75 58.57,47.75 MSP1.42 | Q1.1 62.23,50.6
N$38
  Top 0.254: C5.1 65.48,60.96 65.48,59.13 66.04,58.42 66.04,57.62 66.05,57.62 66.05,57.15 66.05,52.88 65.77,52.6 Q1.2 64.8,49.83 64.8,49.81 62.13,47.14 58.57,47.14 MSP1.41
P1.0_LED1  (via drill 0.35)
  Top 0.254: v47.6,40.44 46.38,39.22 46.38,38.2 MSP1.4
  Bottom 0.254: v47.6,40.44 50.04,40.44 51.87,42.27 59.18,42.27 60.6,40.84 60.6,40.44 57.15,36.98 53.09,36.98 48.62,32.51 48.62,29.26 30.33,10.97 30.33,9.14 29.52,8.33 23.42,8.33 MMW1.6
P1.1_BUTTON1  (via drill 0.35)
  Top 0.254: v43.13,32.92 46.79,36.58 46.79,38 MSP1.5
  Bottom 0.254: v43.13,32.92 24.23,14.02 24.23,10.16 MMW1.5
P1.2_BCLUART_RXD  (via drill 0.35)
  Top 0.254: MSP1.6 47.23,38.04 47.23,36.45 46.99,36.2 46.99,34.29 v44.45,31.75
  Bottom 0.254: v44.45,31.75 41.91,30.48 26.67,15.24 MMW1.4
P1.3_BCLUART_TXD  (via drill 0.35)
  Top 0.254: v47.8,31.29 MSP1.7
  Bottom 0.254: v47.8,31.29 47.8,29.06 29.31,10.57 29.31,10.16 MMW1.3
P1.6_SPIMOSI_J2.15  (via drill 0.35)
  Top 0.254: v32.77,65.43 35.41,65.43 R3.2 | v48.82,39.62 49.23,39.22 49.23,38.2 MSP1.10 | v16.51,45.52 16.1,45.92 15.9,45.92 14.88,46.94 14.88,50.19 12.85,52.22 LV3HP1.2
  Bottom 0.254: v32.77,65.43 19.36,65.43 13.87,70.92 11.63,70.92 10.41,69.7 10.41,54.46 12.65,52.22 LV3HP1.2 | v48.82,39.62 29.52,39.62 28.3,38.41 22.2,38.41 16.51,44.09 v16.51,45.52
P1.7_SPIMISO_J2.14  (via drill 0.35)
  Top 0.254: R2.1 31.75,65.43 15.49,65.43 13.46,63.4 11.63,63.4 10.82,62.59 10.82,56.49 LV3HP1.3 16.1,51.21 v16.1,46.74 | v51.66,40.44 50.04,42.06 49.43,42.06 48.82,41.45 48.82,41.05 49.84,40.03 49.84,38.2 MSP1.11
  Bottom 0.254: v16.1,46.74 15.7,46.33 15.7,44.3 25.65,34.34 45.16,34.34 47.92,34.63 51.73,38.44 51.73,39.23 51.62,39.35 51.62,39.9 51.66,39.94 v51.66,40.44
P2.0_RGBLED_RED  (via drill 0.35)
  Top 0.254: v52.27,39.62 52.27,38.2 MSP1.16 | v40.08,26.21 40.08,10.57 40.49,10.16 MMW2.6
  Bottom 0.254: v52.27,39.62 52.27,38.41 v40.08,26.21
P2.1_RGBLED_GREEN  (via drill 0.35)
  Top 0.254: MSP1.17 52.72,37.79 52.72,37.15 52.27,36.7 52.27,34.88 52.55,34.6 52.55,34.29 v53.34,33.02
  Bottom 0.254: v53.34,33.02 53.34,19.05 MMW2.5
P2.2_RGBLED_BLUE  (via drill 0.35)
  Top 0.254: v53.29,36.17 MSP1.18
  Bottom 0.254: v53.29,36.17 54.56,34.9 54.56,18.95 45.77,10.16 MMW2.4
P2.3_IO_J4.34  (via drill 0.35)
  Top 0.254: MSP1.19 53.71,38.01 53.71,37.15 53.7,37.13 53.7,36.83 55.88,34.29 v55.88,33.02
  Bottom 0.254: v55.88,33.02 55.88,17.78 MMW2.3
P5.2/XT2IN  (via drill 0.35)
  Top 0.254: 58.78,53.65 53.7,58.73 Q2.1 | 58.78,53.65 v59.39,53.03 | C12.1 65.28,54.55 v65.28,53.03 | 58.78,53.65 51.87,46.74 43.33,46.74 MSP1.86
  Bottom 0.254: v59.39,53.03 v65.28,53.03
P5.3/XT2OUT  (via drill 0.35)
  Top 0.254: v65.28,58.12 65.28,57.3 C11.1 | v60.4,57.71 58.78,57.71 56.13,60.35 55.73,60.35 Q2.3 | v41.71,46.94 41.91,47.14 43.13,47.14 MSP1.85
  Bottom 0.254: v65.28,58.12 60.81,58.12 v60.4,57.71 58.57,55.88 58.57,50.39 53.85,45.67 42.98,45.67 v41.71,46.94
P6.4_I2CSDA_J1.10  (via drill 0.35)
  Top 0.254: R6.2 44.35,65.43 41.91,65.43 41.1,66.24 14.28,66.24 12.85,64.82 LV3HP2.2 | v28.5,55.47 31.14,55.47 36.83,55.88 41.91,50.8 MSP1.78
  Bottom 0.254: v28.5,55.47 28.09,55.47 18.95,64.62 12.85,64.62 LV3HP2.2
P6.5_I2CSCL_J1.9  (via drill 0.35)
  Top 0.254: v25.86,63.4 38.46,63.4 39.07,64.01 40.49,64.01 R4.1 | v29.67,57.51 38.86,57.51 44.35,52.02 44.35,50.39 44.15,50.19 43.33,50.19 MSP1.79
  Bottom 0.254: LV3HP2.3 12.85,67.26 16.92,67.26 20.78,63.4 v25.86,63.4 29.67,59.59 v29.67,57.51
P7.4
  Top 0.254: MSP1.26 58.37,39.62 58.37,28.75 57.61,27.99 44.6,27.99 39.27,33.33 TRANSR1.1
P7.5  (via drill 0.35)
  Top 0.254: v55.12,40.64 55.52,40.23 58.37,40.23 MSP1.27 | v39.07,24.18 39.07,22.15 TRANSR2.1
  Bottom 0.254: v55.12,40.64 55.12,40.23 v39.07,24.18
P7.6  (via drill 0.35)
  Top 0.254: v59.79,40.64 58.57,40.64 MSP1.28 | v33.38,19.61 27.5,19.61 TRANSY1.1
  Bottom 0.254: v59.79,40.64 56.13,40.64 39.88,24.38 39.88,23.98 35.51,19.61 v33.38,19.61
P7.7  (via drill 0.35)
  Top 0.254: v55.73,41.45 55.93,41.25 58.37,41.25 MSP1.29 | v26.87,35.15 25.25,33.53 TRANSY2.1
  Bottom 0.254: v55.73,41.45 52.07,41.45 51.71,41.09 51.27,41.09 50.81,40.63 50.8,38.1 48.26,35.56 45.36,35.15 v26.87,35.15
PG
  Top 0.254: U1.3 26.26,52.83 18.95,45.52 R11.2
R1
  Top 0.254: TRANSR1.4 TRANSR1.2 36.83,33.53 34.39,35.97 19.56,35.97 13.66,41.86 12.85,41.86 LED1_RED.1
R2
  Top 0.254: TRANSR2.4 TRANSR2.2 36.83,22.15 35.2,23.77 32.77,23.77 24.23,32.31 24.23,34.14 23.62,34.75 19.96,34.75 19.56,34.34 12.85,34.34 LED2_RED.1
SS
  Top 0.254: U1.1 26.49,55.95 28.85,58.32 50.24,58.32 C18.1
TCK_SWDCLK  (via drill 0.35)
  Top 0.254: v41.1,42.06 41.3,42.27 43.13,42.27 MSP1.95 | v36.83,48.77 v33.73,51.87
  Bottom 0.254: v41.1,42.06 41.1,42.88 41.71,43.48 41.71,43.89 v36.83,48.77 | J8.4 32.36,45.72 30.07,48.01 30.07,49.48 32.89,51.95 v33.73,51.87
TDI  (via drill 0.35)
  Top 0.254: v40.89,43.69 43.13,43.69 MSP1.92 | v35.81,48.77 33.99,50.6 32.16,50.6 31.34,49.78 31.34,49.17 32.36,48.16 J8.8
  Bottom 0.254: v35.81,48.77 v40.89,43.69
TDO_SWO
  Top 0.254: MSP1.93 43.33,43.28 44.15,43.28 44.35,43.08 44.35,39.42 44.15,39.22 36.22,39.22 31.34,44.09 31.34,46.13 32.36,47.14 J8.6
TMS_SWDIO
  Top 0.254: MSP1.94 43.13,42.67 41.5,42.67 41.3,42.88 33.58,42.88 32.56,43.89 32.56,44.3 J8.2
VCORE  (via drill 0.35)
  Top 0.254: v26.67,58.32 C8.1 | 38.25,32.31 30.94,39.62 30.94,49.95 33.02,52.03 33.02,54.05 31.75,54.05 v30.94,54.05 | 38.25,32.31 42.98,27.58 53.34,27.58 55.52,25.4 C10.1 | 38.25,32.31 38.25,34.54 39.27,35.56 44.35,30.48 L1.1 49.53,31.75 49.53,36.45 50.23,37.15 50.23,37.57 MSP1.12
  Bottom 0.254: v30.94,54.05 v26.67,58.32
VSW
  Top 0.254: MSP1.14 51.26,38 51.26,34.75 51.74,34.27 L1.2
XDSET_VCC  (via drill 0.35)
  Top 0.254: IC101.1 23.01,39.22 v22.4,39.22 19.15,39.22 C3.+ | v49.63,41.25 50.85,40.03 50.85,38.2 MSP1.13 | v45.16,51.41 45.77,52.02 45.77,53.24 MSP1.73 | 34.04,61.57 35.41,61.57 C4.1 35.61,61.57 39.47,61.57 40.28,62.38 49.63,62.38 | 34.04,61.57 C7.1 v30.48,62.23 | 49.63,62.38 49.63,64.01 R129.2 49.63,64.21 50.24,64.82 R125.2 | 49.63,62.38 49.63,61.57 R1.1 | C105.1 68.58,50.8 64.77,48.26 63.5,46.99 v60.96,45.72 | v34.04,62.43 34.04,61.57
  Bottom 0.254: 42.11,41.25 36.83,41.25 33.78,44.3 J8.1 33.58,44.3 32.36,43.08 | 42.11,41.25 v49.63,41.25 50.8,43.18 53.34,43.18 55.88,45.72 v60.96,45.72 60.96,41.06 61.01,41.01 61.01,40.27 60.96,40.22 60.96,39.37 64.77,31.75 64.77,19.05 67.36,16.46 67.36,5.84 68.58,4.63 J6.1 | v45.16,51.41 40.89,47.14 40.89,45.31 42.11,44.09 42.11,41.25 | v22.4,39.22 28.5,39.22 32.36,43.08 | 32.36,43.08 29.67,45.77 29.67,49.33 29.66,49.34 29.67,49.49 29.67,49.65 29.68,49.66 29.68,49.67 29.8,49.78 32.54,52.52 33.47,52.52 34.29,53.34 34.29,62.19 v34.04,62.43 | v30.48,62.23 33.02,63.5 33.02,64.75 33.42,65.16 33.42,65.7 33.05,66.07 TP107.1
Y1
  Top 0.254: 22.81,17.88 22.81,16.26 TRANSY1.4 | 22.81,17.88 22.81,21.95 TRANSY1.2 | 22.81,17.88 12.85,17.88 LED1_YELLOW.1
(copper drawn outside any net)
  shapes: Top area x2